# Altium schematic sheet Buck Converter and LDO.SchDoc
size A4
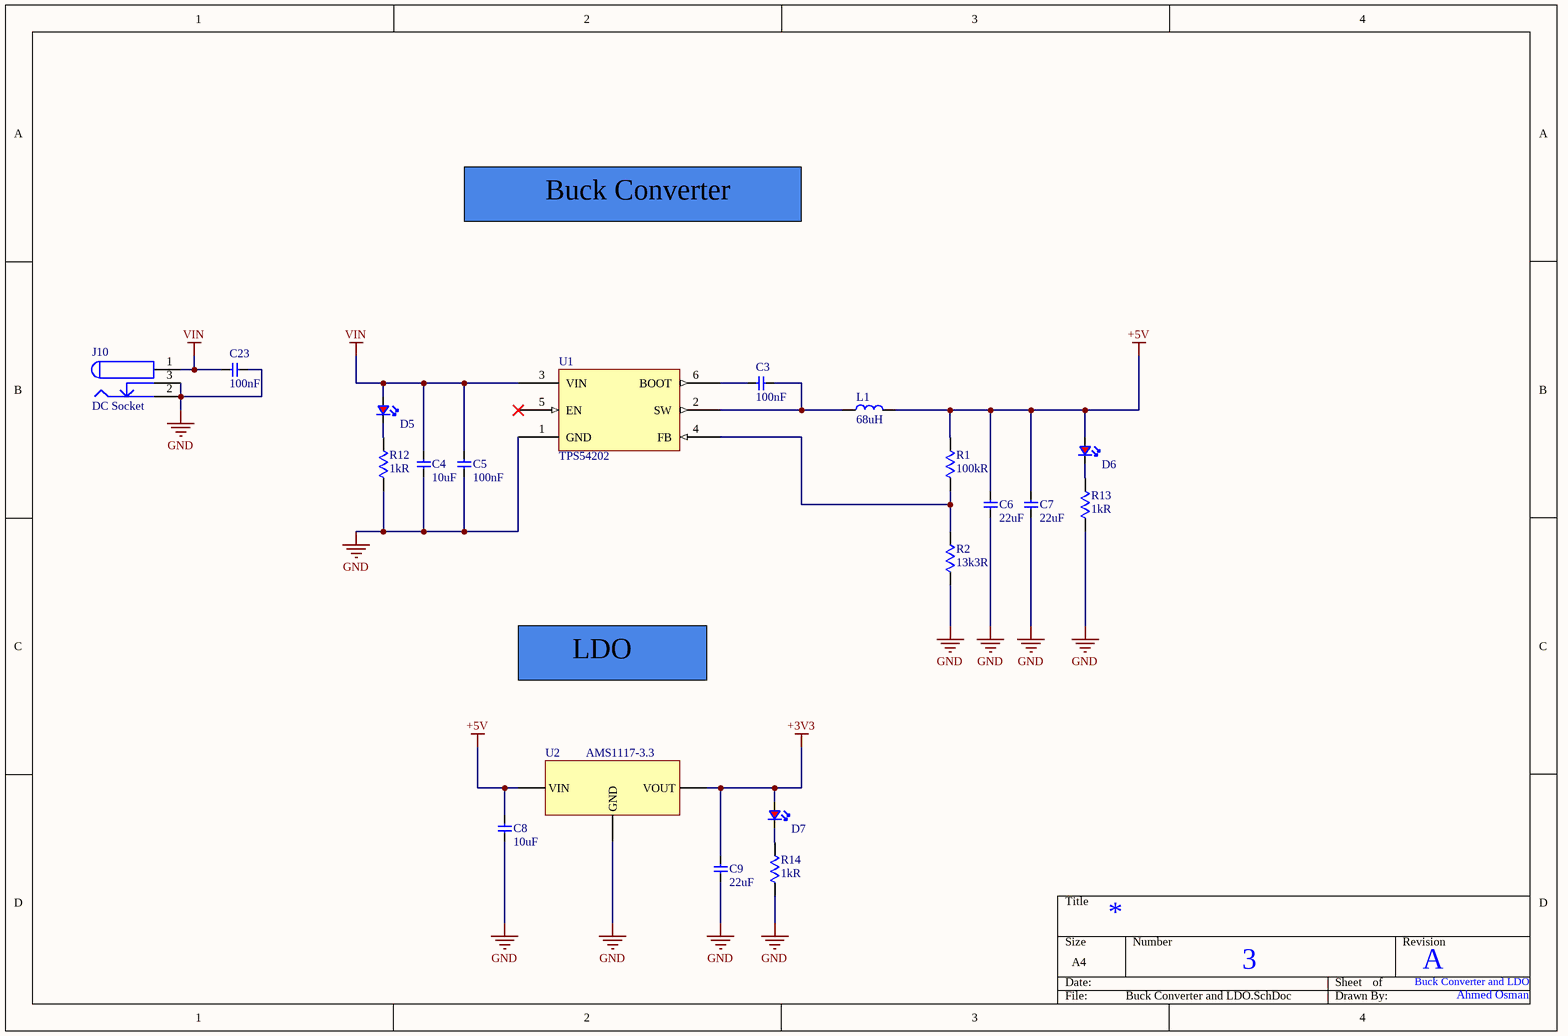
[diagram p0: Buck Converter and LDO.SchDoc]

## Parts
C3  100nF  [CAP 0603]
C4  10uF  [CAP 0603]
C5  100nF  [CAP 0603]
C6  22uF  [CAP 0603]
C7  22uF  [CAP 0603]
C8  10uF  [CAP 0603]
C9  22uF  [CAP 0603]
C23  100nF  [CAP 0603]
D5  LED RED  [LED RED]  (value not drawn)
D6  LED RED  [LED RED]  (value not drawn)
D7  LED RED  [LED RED]  (value not drawn)
J10  DC Socket  [DC Socket]
L1  68uH  [Inductor SMD,12.3x12.3mm]
R1  100kR  [RES 0603]
R2  13k3R  [RES 0603]
R12  1kR  [RES 0603]
R13  1kR  [RES 0603]
R14  1kR  [RES 0603]
U1  TPS54202  [SOT-23-6]
U2  AMS1117-3.3  [SOT-223-3L]

## Nets
+3V3: C9.2 D7.2 U2.2(VOUT)
+5V: C6.2 C7.2 C8.2 D6.2 L1.2 R1.2 U2.3(VIN)
GND: C4.2 C5.1 C6.1 C7.1 C8.1 C9.1 C23.2 J10.2(GND) J10.3(GND) R2.2 R12.1 R13.1 R14.1 U1.1(GND) U2.1(GND)
VIN: C4.1 C5.2 C23.1 D5.2 J10.1(VIN) U1.3(VIN)
NetC3_1: C3.1 U1.6(BOOT)
NetC3_2: C3.2 L1.1 U1.2(SW)
NetD5_1: D5.1 R12.2
NetD6_1: D6.1 R13.2
NetD7_1: D7.1 R14.2
NetR1_1: R1.1 R2.1 U1.4(FB)

Not connected (* = marked no-connect by the designer): U1 5(EN)*

## Notes on the sheet
- Buck Converter
- LDO
- 3
- Buck Converter and LDO
- A
- Ahmed Osman

## Library data of the parts
C3 C5 = CAP  0603 100nF 10% 50 V: 0.1 µF ±10% 50V Ceramic Capacitor X7R 0603 (1608 Metric); Manufacturer 1: Samsung; Manufacturer Part Number 1: CL10B104KB8NNNC; Supplier 1: Digikey; Stock 1: 6418947; Pricing 1: 4000 = 0.00562, 8000 = 0.00513, 12000 = 0.00489, 28000 = 0.00464, 100000 = 0.00336, 200000 = 0.00325, 400000 = 0.00306 (USD); RoHS: Yes; Mount: Surface Mount; Case/Package: 0603; Case Code (Metric): 1608; Case Code (Imperial): 0603; Material: Ceramic; Min Operating Temperature: -55°C; Max Operating Temperature: 125°C; Capacitance: 100nF; Tolerance: 10%; Dielectric: X7R; Voltage: 50V; Voltage Rating (DC): 50V; Voltage Rating: 50V; Package Quantity: 1; Packaging: Tape and Reel; Series: CL; Construction: Flat; Length: 1.6mm; Width: 0.031inch; Height: 0.8mm; Depth: 0.8mm; Thickness: 0.035inch; Radiation Hardening: No; Lead Free: Lead Free; RoHS Compliant: Yes; ComponentLink1URL: https://datasheet.ciiva.com/25803/cl10b104kb8nnnc-25803393.pdf?src-supplier=Digikey; ComponentLink1Description: https://datasheet.ciiva.com/25803/cl10b104kb8nnnc-25803393.pdf?src-supplier=Digikey; ComponentLink2URL: https://datasheet.ciiva.com/26838/getdatasheetpartid-89097-26838411.pdf?src-supplier=Verical; ComponentLink2Description: https://datasheet.ciiva.com/26838/getdatasheetpartid-89097-26838411.pdf?src-supplier=Verical; ComponentLink3URL: https://datasheet.ciiva.com/29198/456651-da-01-en-vs-kondensator-0605-29198839.pdf?src-supplier=Conrad; ComponentLink3Description: https://datasheet.ciiva.com/29198/456651-da-01-en-vs-kondensator-0605-29198839.pdf?src-supplier=Conrad; Supplier Part Number 1: 1276-1000-2-ND; value: 100nF; Manufacturer 2: Samsung; Manufacturer Part Number 2: CL10B104KB8NNNC; Supplier 2: LCSC; Supplier Part Number 2: C1591
C4 = CAP 0603 10 µF ±20% 35V _1: 10 µF ±20% 35V Ceramic Capacitor X5R 0603 (1608 Metric); Manufacturer: Murata; Manufacturer Part Number: GRM188R6YA106MA73D; Supplier 1: Digikey; Stock 1: 432618; Pricing 1: 1 = 0.3, 10 = 0.172, 50 = 0.123, 100 = 0.1077, 500 = 0.0818, 1000 = 0.07373 (USD); RoHS: Yes; Mount: Surface Mount; Case/Package: 0603; Case Code (Metric): 1608; Case Code (Imperial): 0603; Material: Ceramic; Min Operating Temperature: -55°C; Max Operating Temperature: 85°C; Packaging: Cut Tape; Capacitance: 10uF; Voltage Rating: 35V; Tolerance: 20%; Voltage Rating (DC): 35V; Dielectric: X5R; Series: GRM; Length: 0.063inch; Width: 0.031inch; Height: 1mm; Thickness: 0.039inch; RoHS Compliant: Yes; ComponentLink1URL: http://search.murata.co.jp/Ceramy/image/img/A01X/G101/ENG/GRM188R6YA106MA73-01.pdf?src-supplier=Digikey; ComponentLink1Description: http://search.murata.co.jp/Ceramy/image/img/A01X/G101/ENG/GRM188R6YA106MA73-01.pdf?src-supplier=Digikey; ComponentLink2URL: https://www.murata.com/~/media/webrenewal/support/library/catalog/products/capacitor/mlcc/c02e.ashx?la=en-us&src-supplier=Digikey; ComponentLink2Description: https://www.murata.com/~/media/webrenewal/support/library/catalog/products/capacitor/mlcc/c02e.ashx?la=en-us&src-supplier=Digikey; ComponentLink3URL: https://datasheet.octopart.com/GRM188R6YA106MA73D-Murata-datasheet-86813743.pdf?src-supplier=Future+Electronics; ComponentLink3Description: https://datasheet.octopart.com/GRM188R6YA106MA73D-Murata-datasheet-86813743.pdf?src-supplier=Future+Electronics; ComponentLink4URL: https://datasheet.octopart.com/GRM188R6YA106MA73D-Murata-datasheet-149523261.pdf?src-supplier=Newark; ComponentLink4Description: https://datasheet.octopart.com/GRM188R6YA106MA73D-Murata-datasheet-149523261.pdf?src-supplier=Newark; ComponentLink5URL: http://search.murata.co.jp/Ceramy/image/img/A01X/G101/ENG/GRM188R6YA106MA73-01.pdf?src-supplier=Mouser; ComponentLink5Description: http://search.murata.co.jp/Ceramy/image/img/A01X/G101/ENG/GRM188R6YA106MA73-01.pdf?src-supplier=Mouser; ComponentLink6URL: http://search.murata.co.jp/Ceramy/image/img/A01X/G101/ENG/GRM188R6YA106MA73-01.pdf?src-supplier=Future+Electronics; ComponentLink6Description: http://search.murata.co.jp/Ceramy/image/img/A01X/G101/ENG/GRM188R6YA106MA73-01.pdf?src-supplier=Future+Electronics; ComponentLink7URL: http://search.murata.co.jp/Ceramy/image/img/A01X/G101/ENG/GRM188R6YA106MA73-01.pdf?src-supplier=TTI; ComponentLink7Description: http://search.murata.co.jp/Ceramy/image/img/A01X/G101/ENG/GRM188R6YA106MA73-01.pdf?src-supplier=TTI; ComponentLink8URL: https://datasheet.octopart.com/GRM188R6YA106MA73D-Murata-datasheet-165579666.pdf?src-supplier=TME; ComponentLink8Description: https://datasheet.octopart.com/GRM188R6YA106MA73D-Murata-datasheet-165579666.pdf?src-supplier=TME; Supplier Part Number 1: 490-13248-1-ND; Supplier Part Number 2: C194427; Supplier 2: LCSC; value: 10uF
C6 C7 C9 = CAP  0603 22 µF ±20% 10V: 10V 22uF X5R ±20% 0603 Multilayer Ceramic Capacitors MLCC - SMD/SMT ROHS; Supplier 2: LCSC; Supplier Part Number 2: C86295; value: 22uF; Manufacturer 2: Samsung Electro-Mechanics; Manufacturer Part Number 2: CL10A226MP8NUNE
C8 = CAP 0603 10 µF ±20% 35V: 10 µF ±20% 35V Ceramic Capacitor X5R 0603 (1608 Metric); Manufacturer: Murata; Manufacturer Part Number: GRM188R6YA106MA73D; Supplier 1: Digikey; Stock 1: 432618; Pricing 1: 1 = 0.3, 10 = 0.172, 50 = 0.123, 100 = 0.1077, 500 = 0.0818, 1000 = 0.07373 (USD); RoHS: Yes; Mount: Surface Mount; Case/Package: 0603; Case Code (Metric): 1608; Case Code (Imperial): 0603; Material: Ceramic; Min Operating Temperature: -55°C; Max Operating Temperature: 85°C; Packaging: Cut Tape; Capacitance: 10uF; Voltage Rating: 35V; Tolerance: 20%; Voltage Rating (DC): 35V; Dielectric: X5R; Series: GRM; Length: 0.063inch; Width: 0.031inch; Height: 1mm; Thickness: 0.039inch; RoHS Compliant: Yes; ComponentLink1URL: http://search.murata.co.jp/Ceramy/image/img/A01X/G101/ENG/GRM188R6YA106MA73-01.pdf?src-supplier=Digikey; ComponentLink1Description: http://search.murata.co.jp/Ceramy/image/img/A01X/G101/ENG/GRM188R6YA106MA73-01.pdf?src-supplier=Digikey; ComponentLink2URL: https://www.murata.com/~/media/webrenewal/support/library/catalog/products/capacitor/mlcc/c02e.ashx?la=en-us&src-supplier=Digikey; ComponentLink2Description: https://www.murata.com/~/media/webrenewal/support/library/catalog/products/capacitor/mlcc/c02e.ashx?la=en-us&src-supplier=Digikey; ComponentLink3URL: https://datasheet.octopart.com/GRM188R6YA106MA73D-Murata-datasheet-86813743.pdf?src-supplier=Future+Electronics; ComponentLink3Description: https://datasheet.octopart.com/GRM188R6YA106MA73D-Murata-datasheet-86813743.pdf?src-supplier=Future+Electronics; ComponentLink4URL: https://datasheet.octopart.com/GRM188R6YA106MA73D-Murata-datasheet-149523261.pdf?src-supplier=Newark; ComponentLink4Description: https://datasheet.octopart.com/GRM188R6YA106MA73D-Murata-datasheet-149523261.pdf?src-supplier=Newark; ComponentLink5URL: http://search.murata.co.jp/Ceramy/image/img/A01X/G101/ENG/GRM188R6YA106MA73-01.pdf?src-supplier=Mouser; ComponentLink5Description: http://search.murata.co.jp/Ceramy/image/img/A01X/G101/ENG/GRM188R6YA106MA73-01.pdf?src-supplier=Mouser; ComponentLink6URL: http://search.murata.co.jp/Ceramy/image/img/A01X/G101/ENG/GRM188R6YA106MA73-01.pdf?src-supplier=Future+Electronics; ComponentLink6Description: http://search.murata.co.jp/Ceramy/image/img/A01X/G101/ENG/GRM188R6YA106MA73-01.pdf?src-supplier=Future+Electronics; ComponentLink7URL: http://search.murata.co.jp/Ceramy/image/img/A01X/G101/ENG/GRM188R6YA106MA73-01.pdf?src-supplier=TTI; ComponentLink7Description: http://search.murata.co.jp/Ceramy/image/img/A01X/G101/ENG/GRM188R6YA106MA73-01.pdf?src-supplier=TTI; ComponentLink8URL: https://datasheet.octopart.com/GRM188R6YA106MA73D-Murata-datasheet-165579666.pdf?src-supplier=TME; ComponentLink8Description: https://datasheet.octopart.com/GRM188R6YA106MA73D-Murata-datasheet-165579666.pdf?src-supplier=TME; Supplier Part Number 1: 490-13248-1-ND; Supplier Part Number 2: C194427; Supplier 2: LCSC; value: 10uF
C23 = CAP  0603 100 nF 10% 50 V: 0.1 µF ±10% 50V Ceramic Capacitor X7R 0603 (1608 Metric); Manufacturer 1: Samsung; Manufacturer Part Number 1: CL10B104KB8NNNC; Supplier 1: Digikey; Stock 1: 6418947; Pricing 1: 4000 = 0.00562, 8000 = 0.00513, 12000 = 0.00489, 28000 = 0.00464, 100000 = 0.00336, 200000 = 0.00325, 400000 = 0.00306 (USD); RoHS: Yes; Mount: Surface Mount; Case/Package: 0603; Case Code (Metric): 1608; Case Code (Imperial): 0603; Material: Ceramic; Min Operating Temperature: -55°C; Max Operating Temperature: 125°C; Capacitance: 100nF; Tolerance: 10%; Dielectric: X7R; Voltage: 50V; Voltage Rating (DC): 50V; Voltage Rating: 50V; Package Quantity: 1; Packaging: Tape and Reel; Series: CL; Construction: Flat; Length: 1.6mm; Width: 0.031inch; Height: 0.8mm; Depth: 0.8mm; Thickness: 0.035inch; Radiation Hardening: No; Lead Free: Lead Free; RoHS Compliant: Yes; ComponentLink1URL: https://datasheet.ciiva.com/25803/cl10b104kb8nnnc-25803393.pdf?src-supplier=Digikey; ComponentLink1Description: https://datasheet.ciiva.com/25803/cl10b104kb8nnnc-25803393.pdf?src-supplier=Digikey; ComponentLink2URL: https://datasheet.ciiva.com/26838/getdatasheetpartid-89097-26838411.pdf?src-supplier=Verical; ComponentLink2Description: https://datasheet.ciiva.com/26838/getdatasheetpartid-89097-26838411.pdf?src-supplier=Verical; ComponentLink3URL: https://datasheet.ciiva.com/29198/456651-da-01-en-vs-kondensator-0605-29198839.pdf?src-supplier=Conrad; ComponentLink3Description: https://datasheet.ciiva.com/29198/456651-da-01-en-vs-kondensator-0605-29198839.pdf?src-supplier=Conrad; Supplier Part Number 1: 1276-1000-2-ND; value: 100nF; Manufacturer 2: Samsung; Manufacturer Part Number 2: CL10B104KB8NNNC; Supplier 2: LCSC; Supplier Part Number 2: C1591
D5-D7 = LED RED: Red 625nm LED Indication - Discrete 2V 0603 (1608 Metric); Manufacturer 1: Wurth Electronics; Manufacturer Part Number 1: 150060RS75000; Lens Color: Colorless; Viewing Angle: 140°; Lens Style: Clear,Flat,Rectangular; Luminous Intensity: 250mcd; Forward Current: 30mA; Test Current: 20mA; Lens Transparency: Clear; Max Reverse Voltage (DC): 5V; Power Dissipation: 72mW; Lens Size: 0.7mm; Supplier 1: Digikey; Stock 1: 110901; Pricing 1: 1 = 0.15, 50 = 0.142, 100 = 0.122, 500 = 0.105, 1000 = 0.10125 (USD); RoHS: Yes; Mount: Surface Mount; Case/Package: 0603; Color: Red; Case Code (Metric): 1608; Case Code (Imperial): 0603; Min Operating Temperature: -40°C; Max Operating Temperature: 85°C; Package Quantity: 1; Packaging: Cut Tape; Forward Voltage: 2V; Wavelength: 625nm; Dominant Wavelength: 625nm; Series: WL-SMCW; Reverse Voltage: 5V; Length: 1.6mm; Width: 0.8mm; Height: 0.8mm; RoHS Compliant: Yes; Reach SVHC Compliant: Unknown; ComponentLink1URL: https://datasheet.ciiva.com/29563/150060rs75000-29563040.pdf?src-supplier=Digikey; ComponentLink1Description: https://datasheet.ciiva.com/29563/150060rs75000-29563040.pdf?src-supplier=Digikey; Supplier Part Number 1: 732-4978-1-ND; Supplier 2: LCSC; Supplier Part Number 2: C128251; Manufacturer 2: Everlight Elec; Manufacturer Part Number 2: 19-213/R6C-AN2Q1B/3T
J10 = DC Socket: Bend-in DC Power Receptacle -20℃~+70℃ 2.5mm 6.3mm 3A 30V Plugin DC Power Connectors ROHS; Supplier 2: LCSC; Supplier Part Number 2: C720558; Manufacturer 2: XUNPU; Manufacturer Part Number 2: DC-005-A250
L1 = IND  12.3x12.3mm 68uH ±20% 140mΩ_1: 2.1A 68uH ±20% 140mΩ SMD,12.3x12.3mm Inductors (SMD) ROHS; Manufacture: SHOU HAN; Manufacture Part Number: CYH127-68UH; Supplier 2: LCSC; Supplier Part Number 2: C2929504; value: 68uH
R1 = RES  0603 100KR 0.1% 1/10W: 100 kOhms ±0.1% 0.1W, 1/10W Chip Resistor 0603 (1608 Metric) Thin Film; Voltage Rating: 75V; Power Rating: 100mW; Temperature Coefficient: 25ppm/°C; Supplier 1: Digikey; Stock 1: 102412; Pricing 1: 1 = 0.14, 10 = 0.098, 50 = 0.0846, 100 = 0.0755, 500 = 0.0561, 1000 = 0.051 (USD); RoHS: Yes; Mount: Surface Mount; Case/Package: 0603; Case Code (Imperial): 0603; Case Code (Metric): 1608; Min Operating Temperature: -55°C; Max Operating Temperature: 155°C; Packaging: Tape and Reel; Tolerance: 0.1%; Resistance: 100kR; Package Quantity: 5000; Termination: SMD/SMT; Number of Terminations: 2; Max Power Dissipation: 100mW; Voltage Rating (DC): 75V; Features: Moisture Resistant; Series: RT; Technology: THIN FILM; Length: 0.063inch; Width: 0.031inch; Height: 0.022inch; Depth: 0.8mm; RoHS Compliant: Yes; Lead Free: 5697LeadFree; ComponentLink1URL: https://datasheet.ciiva.com/11819/0900766b8079c86e-11819622.pdf?src-supplier=Rs; ComponentLink1Description: https://datasheet.ciiva.com/11819/0900766b8079c86e-11819622.pdf?src-supplier=Rs; Supplier 2: LCSC; Supplier Part Number 2: C122538; Supplier Part Number 1: YAG1235CT-ND; value: 100kR; Manufacturer 2: Yageo; Manufacturer Part Number 2: RT0603BRD07100KL
R2 = RES  0603 13.3kR ±1% 0.1W: 13.3 kOhms ±1% 0.1W, 1/10W Chip Resistor 0603 (1608 Metric) Thin Film; Manufacturer: Yageo; Manufacturer Part Number 1: RT0603FRE0713K3L; Resistance: 13.3kR; Power Rating: 100mW; Voltage Rating: 75V; Temperature Coefficient: 50ppm/°C; Voltage Rating (DC): 50V; Supplier 1: Digikey; Stock 1: 26442; Pricing 1: 1 = 0.1, 10 = 0.018, 50 = 0.0158, 100 = 0.0128, 500 = 0.01224 (USD); RoHS: Yes; Case/Package: 0603; Case Code (Metric): 1608; Case Code (Imperial): 0603; Contact Plating: Tin,Matte; Min Operating Temperature: -55°C; Max Operating Temperature: 125°C; Package Quantity: 5000; Packaging: Tape and Reel; Tolerance: 1%; Number of Terminations: 2; Termination: SMD/SMT; Max Power Dissipation: 100mW; Series: RT; Length: 0.063inch; Width: 0.031inch; Height: 0.022inch; Lead Free: Lead Free; RoHS Compliant: Yes; ComponentLink1URL: https://datasheet.ciiva.com/2559/pyu-rt-1-to-0-05-rohs-l-5-2559525.pdf?src-supplier=Digikey; ComponentLink1Description: https://datasheet.ciiva.com/2559/pyu-rt-1-to-0-05-rohs-l-5-2559525.pdf?src-supplier=Digikey; ComponentLink2URL: https://datasheet.ciiva.com/8890/pyu-rt-1-to-0-05-rohs-l-4-8890911.pdf?src-supplier=Avnet; ComponentLink2Description: https://datasheet.ciiva.com/8890/pyu-rt-1-to-0-05-rohs-l-4-8890911.pdf?src-supplier=Avnet; ComponentLink3URL: https://datasheet.ciiva.com/12703/pyu-rt-1-to-0-05-rohs-l-4-12703147.pdf?src-supplier=Mouser; ComponentLink3Description: https://datasheet.ciiva.com/12703/pyu-rt-1-to-0-05-rohs-l-4-12703147.pdf?src-supplier=Mouser; value: 13k3R; Manufacturer Part Number 2: RT0603BRE0713K3L; Supplier 2: LCSC; Supplier Part Number 2: C861663; Supplier Part Number 1: 13-RT0603FRE0713K3LCT-ND
R12-R14 = RES  0603 1kR ±1% 0.1W: 1 kOhms ±1% 0.1W, 1/10W Chip Resistor 0603 (1608 Metric) Moisture Resistant Thick Film; Manufacturer: Yageo; Manufacturer Part Number 1: RC0603FR-071KL; Power Rating: 100mW; Voltage Rating: 50V; Temperature Coefficient: 100ppm/°C; ComponentLink5URL: http://www.yageo.com/documents/recent/PYu-RC_Group_51_RoHS_L_9.pdf?src-supplier=Arrow+Electronics; ComponentLink5Description: http://www.yageo.com/documents/recent/PYu-RC_Group_51_RoHS_L_9.pdf?src-supplier=Arrow+Electronics; ComponentLink6URL: https://datasheet.octopart.com/RC0603FR-0710KL-Yageo-datasheet-15599030.pdf?src-supplier=Future+Electronics; ComponentLink6Description: https://datasheet.octopart.com/RC0603FR-0710KL-Yageo-datasheet-15599030.pdf?src-supplier=Future+Electronics; Supplier 1: Future Electronics; Stock 1: 15835000; Pricing 1: 5000 = 0.0014, 50000 = 0.0014, 150000 = 0.0013, 375000 = 0.0013, 1000000 = 0.0012 (USD); RoHS: Yes; Case/Package: 0603; Case Code (Imperial): 0603; Case Code (Metric): 1608; Contact Plating: Tin,Matte; Min Operating Temperature: -55°C; Max Operating Temperature: 155°C; Tolerance: 1%; Resistance: 1kR; Packaging: Tape and Reel; Termination: SMD/SMT; Resistor Type: Thick Film; Features: Moisture Resistant; Series: RC; Max Power Dissipation: 100mW; Number of Terminations: 2; Resistance Tolerance: 1%; Construction: Rectangular; Technology: THICK FILM; Length: 1.6mm; Height: 0.45mm; Depth: 0.8mm; Reach SVHC Compliant: No; Military Standard: Not; Lead Free: Lead Free; RoHS Compliant: Yes; Supplier Part Number 1: 4016291; value: 1kR; Supplier 2: LCSC; Supplier Part Number 2: C728580; Manufacturer Part Number 2: RT0603BRB071KL
U1 = TPS54202: Buck Switching Regulator IC Positive Adjustable 0.596V 1 Output 2A SOT-23-6 Thin, TSOT-23-6; Switching Frequency: 500kHz; Number of Outputs: 1; Min Input Voltage: 4.5V; Max Input Voltage: 28V; Min Output Voltage: 596mV; Synchronous Rectifier: Yes; Quiescent Current: 40uA; Max Duty Cycle: 100%; Nominal Supply Current: 45uA; Supplier 1: Digikey; Stock 1: 1445; Pricing 1: 1 = 1.01, 10 = 0.726, 25 = 0.6548, 100 = 0.5771, 250 = 0.53996, 500 = 0.51758, 1000 = 0.49917 (USD); RoHS: Yes; Mount: Surface Mount; Case/Package: SOT-23-6; Number of Pins: 6; Min Operating Temperature: -40°C; Max Operating Temperature: 125°C; Output Current: 2A; Series: Eco-Mode™; Packaging: Tape and Reel; Max Output Voltage: 28V; Output Type: Adjustable; Output Configuration: Positive; Max Supply Voltage: 28V; Min Supply Voltage: 4.5V; Number of Channels: 1; Length: 2.9mm; Width: 1.6mm; Height: 1.1mm; Thickness: 870um; Lead Free: Lead Free; RoHS Compliant: Yes; ComponentLink1URL: http://www.ti.com/general/docs/suppproductinfo.tsp?distId=10&gotoUrl=http%3A%2F%2Fwww.ti.com%2Flit%2Fgpn%2Ftps54202&src-supplier=Digikey; ComponentLink1Description: http://www.ti.com/general/docs/suppproductinfo.tsp?distId=10&gotoUrl=http%3A%2F%2Fwww.ti.com%2Flit%2Fgpn%2Ftps54202&src-supplier=Digikey; ComponentLink2URL: http://www.ti.com/lit/ds/symlink/tps54202.pdf?src-supplier=Digikey; ComponentLink2Description: http://www.ti.com/lit/ds/symlink/tps54202.pdf?src-supplier=Digikey; ComponentLink3URL: http://www.ti.com/general/docs/suppproductinfo.tsp?distId=10&amp;gotoUrl=http%3A%2F%2Fwww.ti.com%2Flit%2Fgpn%2Ftps54202&src-supplier=Digikey; ComponentLink3Description: http://www.ti.com/general/docs/suppproductinfo.tsp?distId=10&amp;gotoUrl=http%3A%2F%2Fwww.ti.com%2Flit%2Fgpn%2Ftps54202&src-supplier=Digikey; Supplier 2: LCSC; Supplier Part Number 2: C191884; Supplier Part Number 1: 296-TPS54202DDCRCT-ND; Manufacturer 2: Texas Instruments; Manufacturer Part Number 2: TPS54202DDCR
U2 = AMS1117-3.3: Linear Voltage Regulator IC Positive Fixed 1 Output 1A SOT-223-3L; Supplier 1: Digikey; Stock 1: 4324; Pricing 1: 1 = 0.68, 10 = 0.407, 25 = 0.3352, 100 = 0.2538, 250 = 0.2138, 500 = 0.18916, 1000 = 0.16853 (USD); RoHS: No; Supplier 2: LCSC; Supplier Part Number 2: C347222; Supplier Part Number 1: 4518-AMS1117-3.3CT-ND; Manufacturer 2: UMW(Youtai Semiconductor Co., Ltd.); Manufacturer Part Number 2: AMS1117-3.3